# Altium schematic sheet POWER_SWITCHES.SCHDOC
size A3
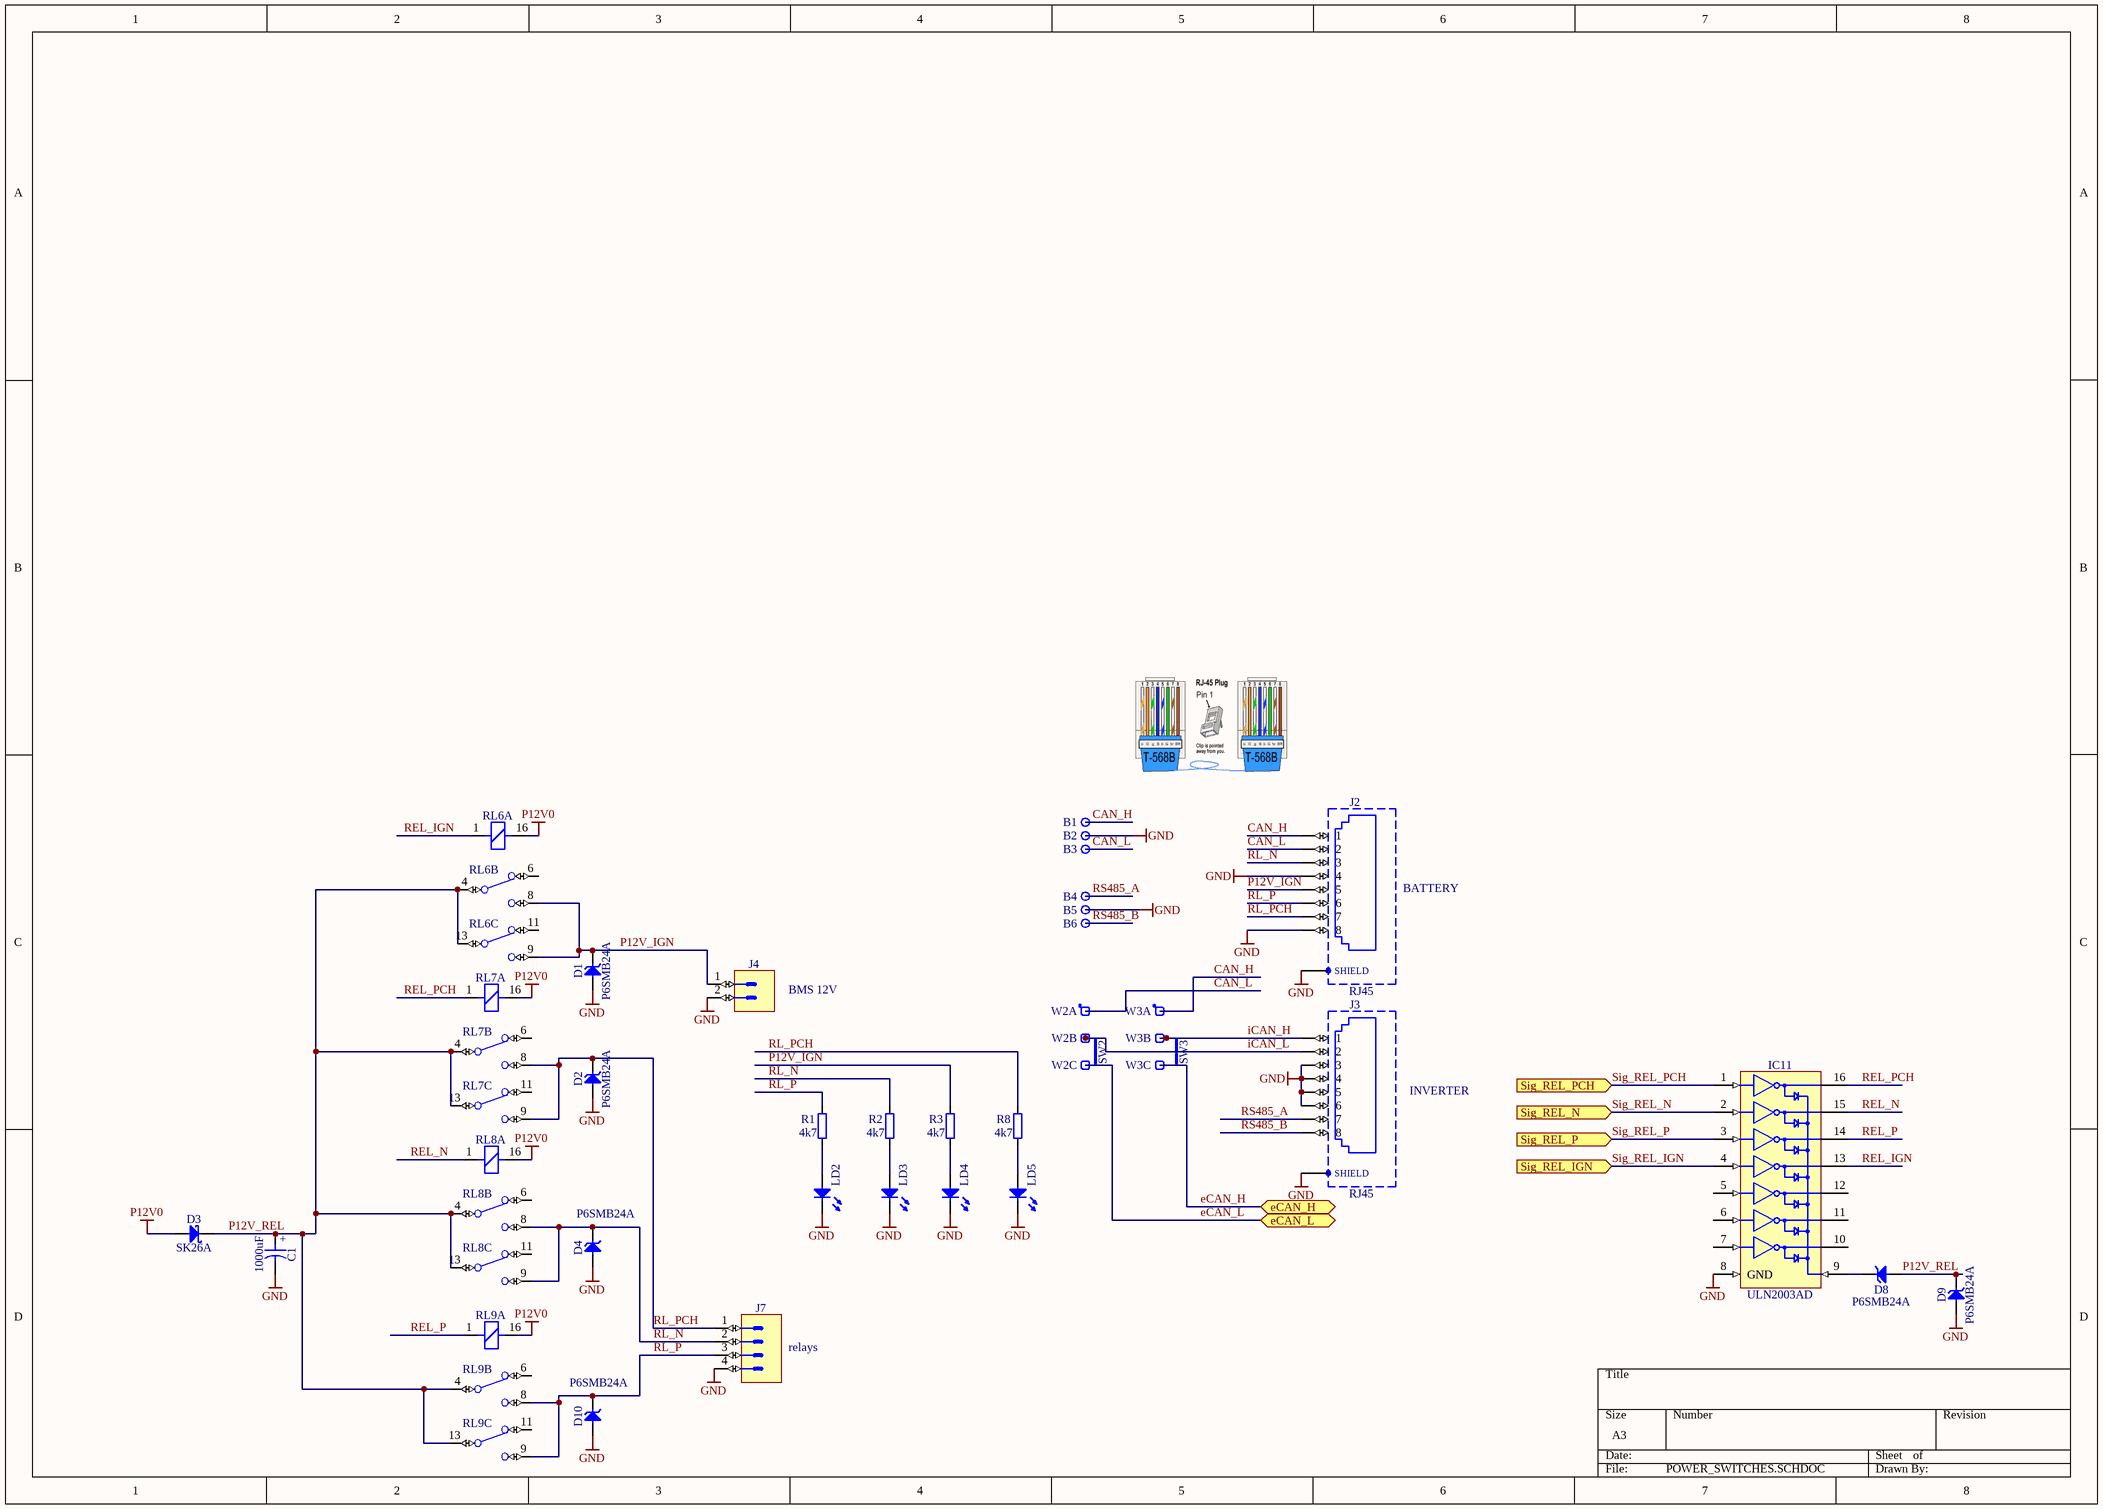
[diagram p0: POWER_SWITCHES.SCHDOC]

## Parts
B1  Plated Hole  [c150h80]  (value not drawn)  (no BOM)
B2  Plated Hole  [c150h80]  (value not drawn)  (no BOM)
B3  Plated Hole  [c150h80]  (value not drawn)  (no BOM)
B4  Plated Hole  [c150h80]  (value not drawn)  (no BOM)
B5  Plated Hole  [c150h80]  (value not drawn)  (no BOM)
B6  Plated Hole  [c150h80]  (value not drawn)  (no BOM)
C1  1000uF  [CAPPR500-1050X2200]
D1  P6SMB24A  [DIOM5436X261N]
D2  P6SMB24A  [DIOM5436X261N]
D3  SK26A  [DIOM5126X265N]
D4  P6SMB24A  [DIOM5436X261N]
D8  P6SMB24A  [DIOM5436X261N]
D9  P6SMB24A  [DIOM5436X261N]
D10  P6SMB24A  [DIOM5436X261N]
IC11  ULN2003AD  [SOIC127P600X175-16N]
J2  RJ45  [HIROSE_TM21R-5C-88]
J3  RJ45  [HIROSE_TM21R-5C-88]
J4  (no value)  [PHOENIX_1803277]
J7  (no value)  [PHOENIX_1803293]
LD2  Green  [LED_KINGBRIGHT_KP-1608CGCK]  (value not drawn)
LD3  Green  [LED_KINGBRIGHT_KP-1608CGCK]  (value not drawn)
LD4  Green  [LED_KINGBRIGHT_KP-1608CGCK]  (value not drawn)
LD5  Green  [LED_KINGBRIGHT_KP-1608CGCK]  (value not drawn)
R1  4k7  [RESC1608X55N]
R2  4k7  [RESC1608X55N]
R3  4k7  [RESC1608X55N]
R8  4k7  [RESC1608X55N]
RL6  REL_TYCO-AXICOM_MT2  [REL_TYCO-AXICOM_MT2]  (value not drawn)  (parts A,B,C of 3)
RL7  REL_TYCO-AXICOM_MT2  [REL_TYCO-AXICOM_MT2]  (value not drawn)  (parts A,B,C of 3)
RL8  REL_TYCO-AXICOM_MT2  [REL_TYCO-AXICOM_MT2]  (value not drawn)  (parts A,B,C of 3)
RL9  REL_TYCO-AXICOM_MT2  [REL_TYCO-AXICOM_MT2]  (value not drawn)  (parts A,B,C of 3)
SW2  Jumper Type1  [JUMPER_BLACK_INSULATED_2.54MM]  (value not drawn)
SW3  Jumper Type1  [JUMPER_BLACK_INSULATED_2.54MM]  (value not drawn)
W2  Test Point  [COMATEL_385.0358.1.03.400]  (value not drawn)  (parts A,B,C of 3)
W3  Test Point  [COMATEL_385.0358.1.03.400]  (value not drawn)  (parts A,B,C of 3)

## Ports
eCAN_H (bidir), eCAN_L (bidir), Sig_REL_IGN (in), Sig_REL_N (in), Sig_REL_P (in), Sig_REL_PCH (in)

## Nets
GND: B2.1 B5.1 C1.2 D1.2(A) D2.2(A) D4.2(A) D9.2(A) D10.2(A) IC11.8(GND) J2.4 J2.8 J2.SHIELD J3.3 J3.4 J3.5 J3.6 J3.SHIELD J4.2 J7.4 LD2.1(C) LD3.1(C) LD4.1(C) LD5.1(C)
P12V0: D3.2(A) RL6.16 RL7.16 RL8.16 RL9.16
CAN_H: B1.1 J2.1 W3.1
CAN_L: B3.1 J2.2 W2.1
eCAN_H: W3.3 ; port eCAN_H
eCAN_L: W2.3 ; port eCAN_L
iCAN_H: J3.1 SW3.1 W3.2
iCAN_L: J3.2 SW2.1 W2.2
P12V_IGN: D1.1(C) J2.5 J4.1 R3.2 RL6.8(NO) RL6.9(NO)
P12V_REL: C1.1 D3.1(C) D8.2(A) D9.1(C) RL6.4(C) RL6.13(C) RL7.4(C) RL7.13(C) RL8.4(C) RL8.13(C) RL9.4(C) RL9.13(C)
REL_IGN: IC11.13(OUT4) RL6.1
REL_N: IC11.15(OUT2) RL8.1
REL_P: IC11.14(OUT3) RL9.1
REL_PCH: IC11.16(OUT1) RL7.1
RL_N: D4.1(C) J2.3 J7.2 R2.2 RL8.8(NO) RL8.9(NO)
RL_P: D10.1(C) J2.6 J7.3 R1.2 RL9.8(NO) RL9.9(NO)
RL_PCH: D2.1(C) J2.7 J7.1 R8.2 RL7.8(NO) RL7.9(NO)
RS485_A: B4.1 J3.7
RS485_B: B6.1 J3.8
Sig_REL_IGN: IC11.4(IN4) ; port Sig_REL_IGN
Sig_REL_N: IC11.2(IN2) ; port Sig_REL_N
Sig_REL_P: IC11.3(IN3) ; port Sig_REL_P
Sig_REL_PCH: IC11.1(IN1) ; port Sig_REL_PCH
NetD8_1: D8.1(C) IC11.9(COM)
NetLD2_2: LD2.2(A) R1.1
NetLD3_2: LD3.2(A) R2.1
NetLD4_2: LD4.2(A) R3.1
NetLD5_2: LD5.2(A) R8.1

Not connected (* = marked no-connect by the designer): IC11 5(IN5) 6(IN6) 7(IN7) 10(OUT7) 11(OUT6) 12(OUT5); RL6 6(NC) 11(NC); RL7 6(NC) 11(NC); RL8 6(NC) 11(NC); RL9 6(NC) 11(NC)

## Notes on the sheet
- BATTERY
- BMS 12V
- INVERTER
- (near J7) relays
- (in symbol CAER_1000UF_25V_20%_VISHAY_MAL203856102E3) +

## Library data of the parts
B1-B6 = PLATED_HOLE0.8_PAD1.5: Single Terminal Socket; Part Description: Plated Through Hole: Hole Dia.=0.8mm Pad Dia.=1.5mm, IPC-7251 Level A; Mounted: No; Part Number: PLATED_HOLE0.8_PAD1.5; Component Type: Standard (No BOM); Pin Count: 1; Family: Plated Hole; Socket: No; SMD: No; Sense: No; Status: None; ComponentHeight: 0mm; HelpURL: Undefined; Author: CERN DEM JLC; CreateDate: 11.05.2017; LatestRevisionDate: 11.05.2017; PackageDescription: Plated Through Hole: Hole Dia.=0.8mm Pad Dia.=1.3mm, IPC-7251 Level A
C1 = CAER_1000UF_25V_20%_VISHAY_MAL203856102E3: Polarised capacitor; Part Description: Radial Standard Ultra Miniature Aluminum Electrolytic Capacitor (038 RSU Series); Manufacturer: VISHAY BCCOMPONENTS; Voltage: 25V; Tolerance: ±20%; Part Number: CAER_1000UF_25V_20%_VISHAY_MAL203856102E3; Component Kind: Standard; Component Type: Standard; Pin Count: 2; Value: 1000uF; Status: None; Manufacturer Part Number: MAL203856102E3; Case: LS5 D10.5 x H22; Mounted: Yes; Socket: No; SMD: No; Sense: No; ComponentHeight: 22mm; HelpURL: \\cern.ch\dfs\Applications\Altium\Datasheets\CAER_VISHAY_038 RSU.pdf; Author: CERN DEM JLC; CreateDate: 2012-08-27; LatestRevisionDate: 2012-08-27
D1 D2 D4 D8-D10 = P6SMB24A: Transient Voltage Suppressor Diode (Uni-Directional); Part Description: Uni-directional Transient Voltage Suppressor (TVS) Diode; Manufacturer: LITTELFUSE; Voltage: 24V; Power: 600W; PressFit: No; Bonding: No; Part Number: P6SMB24A; Component Kind: Standard; Component Type: Standard; Device: P6SMB24A; PackageDescription: DO-214-AA/SMB Diode, Molded Body; 5.40mm L X 3.62mm W X 2.61mm H, IPC Medium Density; Manufacturer Part Number: P6SMB24A; Pin Count: 2; Case: SMB; Mounted: Yes; Socket: No; SMD: Yes; Sense: No; ComponentHeight: 2.61mm; HelpURL: \\cern.ch\dfs\Applications\Altium\Datasheets\P6SMB24A.pdf; Author: CERN DEM JLC; CreateDate: 12.07.2017; LatestRevisionDate: 12.07.2017
D3 = SK26A: Schottky Diode; Part Description: 2A, 60V Surface Mount Schottky Barrier Rectifier; Manufacturer: TAIWAN SEMICONDUCTOR; Voltage: 60V; Power: 2A; PressFit: No; Bonding: No; Part Number: SK26A; Component Kind: Standard; Component Type: Standard; Device: SK26A; PackageDescription: DO-214-AC/SMA Molded Diode, 2-Leads, Body 5.1x2.6mm, IPC Medium Density; Manufacturer Part Number: SK26A; Pin Count: 2; Case: DO-214AC; Mounted: Yes; Socket: No; SMD: Yes; Sense: No; ComponentHeight: 2.5mm; HelpURL: \\cern.ch\dfs\Applications\Altium\Datasheets\SK26A.pdf; Author: CERN DEM JMW; CreateDate: 2015-08-07; LatestRevisionDate: 2015-08-07
IC11 = ULN2003AD: Seven darlington array; Part Description: High-Voltage High-Current Darlington Array; Manufacturer: TEXAS INSTRUMENTS; PressFit: No; Bonding: No; Part Number: ULN2003AD; Component Kind: Standard; Component Type: Standard; Device: ULN2003AD; PackageDescription: SOIC 16, Pitch 1.27mm - Body 4x10mm, IPC Medium Density; Manufacturer Part Number: ULN2003AD; Pin Count: 16; Case: SOIC16; Mounted: Yes; Socket: No; SMD: Yes; Sense: No; ComponentHeight: 1.75mm; Author: CERN DEM JLC; HelpURL: \\cern.ch\dfs\Applications\Altium\Datasheets\ULN2003AD.pdf; CreateDate: 2009-08-04; LatestRevisionDate: 2009-08-04
J2 J3 = HIROSE_TM21R-5C-88(50): Connector RJ45 + Shield; Part Description: 1 Port, Tab-Down, Horizontal Shielded 8P8C RJ45 Modular Jack Connectors for High-speed LAN Transmission; Manufacturer: HIROSE (HRS); PressFit: No; Part Number: HIROSE_TM21R-5C-88(50); Component Kind: Standard; Component Type: Standard; Pin Count: 10; Family: RJ45; Mounted: Yes; Socket: No; SMD: No; Sense: No; Status: None; Manufacturer Part Number: TM21R-5C-88(50); ComponentHeight: 13.75mm; HelpURL: \\cern.ch\dfs\Applications\Altium\Datasheets\HIROSE_TM21R-5C-88.pdf; Author: CERN DEM BC; CreateDate: 08.09.2020; LatestRevisionDate: 08.09.2020
J4 = PHOENIX_1803277: Connector 2 Male; Part Description: 8A 160 V, Pitch: 3.81mm, 2 Positions  Right Angled Header; Manufacturer: PHOENIX CONTACT; Manufacturer Part Number: 1803277 (MC 1,5/ 2-G-3,81); PressFit: No; Part Number: PHOENIX_1803277; Component Kind: Standard; Component Type: Standard; Pin Count: 2; Mounted: Yes; Socket: No; SMD: No; Sense: No; Status: None; ComponentHeight: 7.25mm; HelpURL: \\cern.ch\dfs\Applications\Altium\Datasheets\PHOENIX_1803277.pdf; Author: CERN DEM JLC; CreateDate: 06.05.2014; LatestRevisionDate: 06.05.2014
J7 = PHOENIX_1803293: Connector 4 Male; Part Description: 8A 160 V, Pitch: 3.81mm, 4 Positions  Right Angled Header; Manufacturer: PHOENIX CONTACT; Manufacturer Part Number: 1803293 (MC 1,5/ 4-G-3,81); PressFit: No; Part Number: PHOENIX_1803293; Component Kind: Standard; Component Type: Standard; Pin Count: 4; Mounted: Yes; Socket: No; SMD: No; Sense: No; Status: None; ComponentHeight: 7.25mm; HelpURL: \\cern.ch\dfs\Applications\Altium\Datasheets\PHOENIX_1803293.pdf; Author: CERN DEM JLC; CreateDate: 06.05.2014; LatestRevisionDate: 06.05.2014
LD2-LD5 = LED_KINGBRIGHT_KP-1608CGCK: LED Green 1C 2A; Part Description: 1.6x0.8mm SMD Chip Green LED Lamp; PressFit: No; Bonding: No; Part Number: LED_KINGBRIGHT_KP-1608CGCK; Component Kind: Standard; Component Type: Standard; Color: Green; PackageDescription: SMT Green LED, Case 0603, Body L 1.60mm x W 0.80mm x H 1.10mm; Manufacturer: KINGBRIGHT; Manufacturer Part Number: KP-1608CGCK; Pin Count: 2; Case: 0603; Mounted: Yes; Socket: No; SMD: Yes; Sense: No; ComponentHeight: 1.1mm; HelpURL: \\cern.ch\dfs\Applications\Altium\Datasheets\LED_KINGBRIGHT_KP-1608CGCK.pdf; Author: CERN DEM HF; CreateDate: 01.10.2021; LatestRevisionDate: 01.10.2021
R1-R3 R8 = R0603_4K7_1%_0.1W_100PPM: Resistor - 1%; Part Description: General Purpose Thick Film Chip Resistor; Manufacturer: GENERIC; Manufacturer1 Part Number: NRC06F4701TRF; Power: 0.1W; TC: ±100ppm/°C; PressFit: No; Part Number: R0603_4K7_1%_0.1W_100PPM; Component Kind: Standard; Component Type: Standard; Pin Count: 2; Value: 4k7; Status: Preferred; Tolerance: ±1%; Manufacturer Part Number: R0603_4K7_1%_0.1W_100PPM; Case: 0603; Mounted: Yes; Sense: No; Socket: No; SMD: Yes; Manufacturer1 Example: NIC COMPONENT; Manufacturer1 ComponentHeight: 0.55mm; HelpURL: \\cern.ch\dfs\Applications\Altium\Datasheets\R0603_NIC_NRC.pdf; Author: CERN DEM JLC; CreateDate: 03.12.2007; LatestRevisionDate: 13.03.2008
RL6-RL9 = REL_TYCO-AXICOM_C93402: DPDT Signal and RF Relay, MT2 Serie; Part Description: DPDT Communications/Signal Relay (150mW High Sensitive Coil), MT2 Series; Manufacturer: TYCO AXICOM; Manufacturer Part Number: C93402 or 1462000-7; PressFit: No; Value: 12VDC; Sense Comment: Cleaning Limitation; Status Comment: Sensitive (See Sensitive Field); Part Number: REL_TYCO-AXICOM_C93402; Component Kind: Standard; Component Type: Standard; Pin Count: 8; PackageDescription: 8 Leads, Row Spacing 7.62mm; Body 20.25mm x 10.05mm, AXICOM MT2 Series; Mounted: Yes; Socket: No; SMD: No; Sense: Yes; Status: Not Recommended; ComponentHeight: 11.2mm; HelpURL: \\cern.ch\dfs\Applications\Altium\Datasheets\REL_TYCO-AXICOM_MT2.pdf; Author: CERN DEM JLC; CreateDate: 24.05.2012; LatestRevisionDate: 04.09.2018
SW2 SW3 = COMATEL_313.1730.0.00.40.0: Jumper 1 Pin; Part Description: Closed Insulated Black Jumper Pitch 2.54mm; Manufacturer: KONTEK COMATEL; PressFit: No; SCEM: 09.55.10.960.9; Part Number: COMATEL_313.1730.0.00.40.0; Component Kind: Accessories; Component Type: Standard; Pin Count: 1; Family: Jumper; Mounted: Yes; Socket: No; SMD: No; Sense: No; Status: Obsolete; Manufacturer Part Number: 313.1730.0.00.40.0; ComponentHeight: 6.5mm; HelpURL: \\cern.ch\dfs\Applications\Altium\Datasheets\COMATEL_313.1730.0.00.40.0.pdf; Author: CERN DEM JLC; CreateDate: 09.04.2008; LatestRevisionDate: 27.08.2013
W2 W3 = COMATEL_385.0358.1.03.400: 3 Mini Wire-Wrap Contact Strip Header; Part Description: 3 Contacts Straight Strip Header Pitch 2.54mm L=6.3mm ''Mini-Wire-Wrap''; Manufacturer: KONTEK COMATEL; PressFit: No; Part Number: COMATEL_385.0358.1.03.400; Component Kind: Standard; Component Type: Standard; Pin Count: 3; Family: Test Point; Mounted: Yes; Socket: No; SMD: No; Sense: No; Status: Not recommended; Manufacturer Part Number: 385.0358.1.03.400; ComponentHeight: 8mm; HelpURL: \\cern.ch\dfs\Applications\Altium\Datasheets\COMATEL_385.0358.1.03.400.pdf; Author: CERN DEM JLC; CreateDate: 30.06.2010; LatestRevisionDate: 10.10.2012